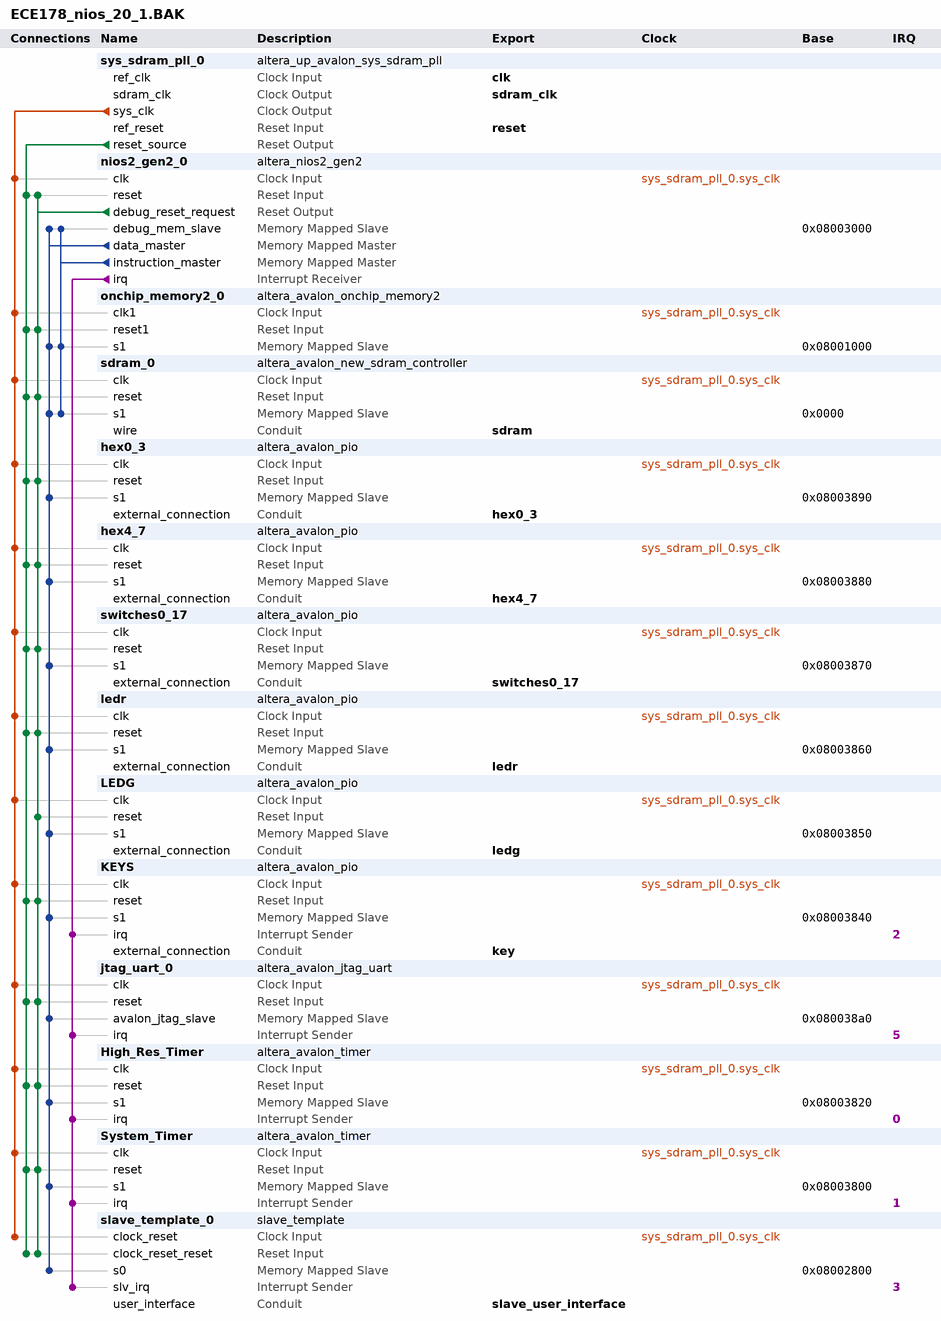
[diagram p0: system contents]
# Platform Designer (Qsys) system ECE178_nios_20_1.BAK, Cyclone IV E EP4CE115F29C7
# Parameters at their usual value, and those the tool derives, are not listed.
package require -exact qsys 20.1
create_system ECE178_nios_20_1.BAK
set_project_property DEVICE_FAMILY {Cyclone IV E}
set_project_property DEVICE EP4CE115F29C7

add_instance sys_sdram_pll_0 altera_up_avalon_sys_sdram_pll 18.0
set_instance_parameter_value sys_sdram_pll_0 CV_boards DE10-Standard
set_instance_parameter_value sys_sdram_pll_0 gui_outclk 50.0
set_instance_parameter_value sys_sdram_pll_0 gui_refclk 50.0

add_instance nios2_gen2_0 altera_nios2_gen2 20.1
set_instance_parameter_value nios2_gen2_0 dcache_size 2048
set_instance_parameter_value nios2_gen2_0 exceptionSlave sdram_0.s1
set_instance_parameter_value nios2_gen2_0 icache_size 2048
set_instance_parameter_value nios2_gen2_0 impl Tiny
set_instance_parameter_value nios2_gen2_0 resetSlave sdram_0.s1

add_instance onchip_memory2_0 altera_avalon_onchip_memory2 20.1
set_instance_parameter_value onchip_memory2_0 dataWidth 32
set_instance_parameter_value onchip_memory2_0 dualPort false
set_instance_parameter_value onchip_memory2_0 initMemContent true
set_instance_parameter_value onchip_memory2_0 initializationFileName onchip_mem.hex
set_instance_parameter_value onchip_memory2_0 memorySize 4096

add_instance sdram_0 altera_avalon_new_sdram_controller 20.1
set_instance_parameter_value sdram_0 TAC 5.5
set_instance_parameter_value sdram_0 TRCD 20.0
set_instance_parameter_value sdram_0 TRP 20.0
set_instance_parameter_value sdram_0 casLatency 3
set_instance_parameter_value sdram_0 columnWidth 10
set_instance_parameter_value sdram_0 dataWidth 32
set_instance_parameter_value sdram_0 generateSimulationModel false
set_instance_parameter_value sdram_0 model single_Micron_MT48LC4M32B2_7_chip
set_instance_parameter_value sdram_0 numberOfBanks 4
set_instance_parameter_value sdram_0 numberOfChipSelects 1
set_instance_parameter_value sdram_0 powerUpDelay 200.0
set_instance_parameter_value sdram_0 refreshPeriod 7.8125
set_instance_parameter_value sdram_0 rowWidth 13

add_instance hex0_3 altera_avalon_pio 20.1
set_instance_parameter_value hex0_3 direction Output
set_instance_parameter_value hex0_3 width 32

add_instance hex4_7 altera_avalon_pio 20.1
set_instance_parameter_value hex4_7 direction Output
set_instance_parameter_value hex4_7 width 32

add_instance switches0_17 altera_avalon_pio 20.1
set_instance_parameter_value switches0_17 direction Input
set_instance_parameter_value switches0_17 width 18

add_instance ledr altera_avalon_pio 20.1
set_instance_parameter_value ledr direction Output
set_instance_parameter_value ledr width 18

add_instance LEDG altera_avalon_pio 20.1
set_instance_parameter_value LEDG direction Output
set_instance_parameter_value LEDG width 9

add_instance KEYS altera_avalon_pio 20.1
set_instance_parameter_value KEYS captureEdge true
set_instance_parameter_value KEYS direction Input
set_instance_parameter_value KEYS edgeType ANY
set_instance_parameter_value KEYS generateIRQ true
set_instance_parameter_value KEYS width 4

add_instance jtag_uart_0 altera_avalon_jtag_uart 20.1
set_instance_parameter_value jtag_uart_0 simInteractiveOptions NO_INTERACTIVE_WINDOWS

add_instance High_Res_Timer altera_avalon_timer 20.1
set_instance_parameter_value High_Res_Timer period 1
set_instance_parameter_value High_Res_Timer periodUnits USEC

add_instance System_Timer altera_avalon_timer 20.1
set_instance_parameter_value System_Timer period 1
set_instance_parameter_value System_Timer periodUnits MSEC

add_instance slave_template_0 slave_template 2.0
set_instance_parameter_value slave_template_0 DATA_WIDTH 32
set_instance_parameter_value slave_template_0 ENABLE_SYNC_SIGNALS 0
set_instance_parameter_value slave_template_0 IRQ_EN 0
set_instance_parameter_value slave_template_0 MODE_0 2
set_instance_parameter_value slave_template_0 MODE_1 2
set_instance_parameter_value slave_template_0 MODE_10 2
set_instance_parameter_value slave_template_0 MODE_11 2
set_instance_parameter_value slave_template_0 MODE_12 2
set_instance_parameter_value slave_template_0 MODE_13 2
set_instance_parameter_value slave_template_0 MODE_14 2
set_instance_parameter_value slave_template_0 MODE_15 2
set_instance_parameter_value slave_template_0 MODE_2 2
set_instance_parameter_value slave_template_0 MODE_3 2
set_instance_parameter_value slave_template_0 MODE_4 2
set_instance_parameter_value slave_template_0 MODE_5 2
set_instance_parameter_value slave_template_0 MODE_6 2
set_instance_parameter_value slave_template_0 MODE_7 2
set_instance_parameter_value slave_template_0 MODE_8 2
set_instance_parameter_value slave_template_0 MODE_9 2

# connections
add_connection sys_sdram_pll_0.sys_clk hex0_3.clk clock
add_connection sys_sdram_pll_0.sys_clk hex4_7.clk clock
add_connection sys_sdram_pll_0.sys_clk High_Res_Timer.clk clock
add_connection sys_sdram_pll_0.sys_clk jtag_uart_0.clk clock
add_connection sys_sdram_pll_0.sys_clk KEYS.clk clock
add_connection sys_sdram_pll_0.sys_clk LEDG.clk clock
add_connection sys_sdram_pll_0.sys_clk ledr.clk clock
add_connection sys_sdram_pll_0.sys_clk nios2_gen2_0.clk clock
add_connection sys_sdram_pll_0.sys_clk onchip_memory2_0.clk1 clock
add_connection sys_sdram_pll_0.sys_clk sdram_0.clk clock
add_connection sys_sdram_pll_0.sys_clk slave_template_0.clock_reset clock
add_connection sys_sdram_pll_0.sys_clk switches0_17.clk clock
add_connection sys_sdram_pll_0.sys_clk System_Timer.clk clock
add_connection nios2_gen2_0.debug_reset_request hex0_3.reset reset
add_connection nios2_gen2_0.debug_reset_request hex4_7.reset reset
add_connection nios2_gen2_0.debug_reset_request High_Res_Timer.reset reset
add_connection nios2_gen2_0.debug_reset_request jtag_uart_0.reset reset
add_connection nios2_gen2_0.debug_reset_request KEYS.reset reset
add_connection nios2_gen2_0.debug_reset_request LEDG.reset reset
add_connection nios2_gen2_0.debug_reset_request ledr.reset reset
add_connection nios2_gen2_0.debug_reset_request nios2_gen2_0.reset reset
add_connection nios2_gen2_0.debug_reset_request onchip_memory2_0.reset1 reset
add_connection nios2_gen2_0.debug_reset_request sdram_0.reset reset
add_connection nios2_gen2_0.debug_reset_request slave_template_0.clock_reset_reset reset
add_connection nios2_gen2_0.debug_reset_request switches0_17.reset reset
add_connection nios2_gen2_0.debug_reset_request System_Timer.reset reset
add_connection sys_sdram_pll_0.reset_source hex0_3.reset reset
add_connection sys_sdram_pll_0.reset_source hex4_7.reset reset
add_connection sys_sdram_pll_0.reset_source High_Res_Timer.reset reset
add_connection sys_sdram_pll_0.reset_source jtag_uart_0.reset reset
add_connection sys_sdram_pll_0.reset_source KEYS.reset reset
add_connection sys_sdram_pll_0.reset_source ledr.reset reset
add_connection sys_sdram_pll_0.reset_source nios2_gen2_0.reset reset
add_connection sys_sdram_pll_0.reset_source onchip_memory2_0.reset1 reset
add_connection sys_sdram_pll_0.reset_source sdram_0.reset reset
add_connection sys_sdram_pll_0.reset_source slave_template_0.clock_reset_reset reset
add_connection sys_sdram_pll_0.reset_source switches0_17.reset reset
add_connection sys_sdram_pll_0.reset_source System_Timer.reset reset
add_connection nios2_gen2_0.data_master hex0_3.s1 avalon
set_connection_parameter_value nios2_gen2_0.data_master/hex0_3.s1 baseAddress 0x08003890
add_connection nios2_gen2_0.data_master hex4_7.s1 avalon
set_connection_parameter_value nios2_gen2_0.data_master/hex4_7.s1 baseAddress 0x08003880
add_connection nios2_gen2_0.data_master High_Res_Timer.s1 avalon
set_connection_parameter_value nios2_gen2_0.data_master/High_Res_Timer.s1 baseAddress 0x08003820
add_connection nios2_gen2_0.data_master jtag_uart_0.avalon_jtag_slave avalon
set_connection_parameter_value nios2_gen2_0.data_master/jtag_uart_0.avalon_jtag_slave baseAddress 0x080038a0
add_connection nios2_gen2_0.data_master KEYS.s1 avalon
set_connection_parameter_value nios2_gen2_0.data_master/KEYS.s1 baseAddress 0x08003840
add_connection nios2_gen2_0.data_master LEDG.s1 avalon
set_connection_parameter_value nios2_gen2_0.data_master/LEDG.s1 baseAddress 0x08003850
add_connection nios2_gen2_0.data_master ledr.s1 avalon
set_connection_parameter_value nios2_gen2_0.data_master/ledr.s1 baseAddress 0x08003860
add_connection nios2_gen2_0.data_master nios2_gen2_0.debug_mem_slave avalon
set_connection_parameter_value nios2_gen2_0.data_master/nios2_gen2_0.debug_mem_slave baseAddress 0x08003000
add_connection nios2_gen2_0.data_master onchip_memory2_0.s1 avalon
set_connection_parameter_value nios2_gen2_0.data_master/onchip_memory2_0.s1 baseAddress 0x08001000
add_connection nios2_gen2_0.data_master sdram_0.s1 avalon
set_connection_parameter_value nios2_gen2_0.data_master/sdram_0.s1 baseAddress 0x0000
add_connection nios2_gen2_0.data_master slave_template_0.s0 avalon
set_connection_parameter_value nios2_gen2_0.data_master/slave_template_0.s0 baseAddress 0x08002800
add_connection nios2_gen2_0.data_master switches0_17.s1 avalon
set_connection_parameter_value nios2_gen2_0.data_master/switches0_17.s1 baseAddress 0x08003870
add_connection nios2_gen2_0.data_master System_Timer.s1 avalon
set_connection_parameter_value nios2_gen2_0.data_master/System_Timer.s1 baseAddress 0x08003800
add_connection nios2_gen2_0.instruction_master nios2_gen2_0.debug_mem_slave avalon
set_connection_parameter_value nios2_gen2_0.instruction_master/nios2_gen2_0.debug_mem_slave baseAddress 0x08003000
add_connection nios2_gen2_0.instruction_master onchip_memory2_0.s1 avalon
set_connection_parameter_value nios2_gen2_0.instruction_master/onchip_memory2_0.s1 baseAddress 0x08001000
add_connection nios2_gen2_0.instruction_master sdram_0.s1 avalon
set_connection_parameter_value nios2_gen2_0.instruction_master/sdram_0.s1 baseAddress 0x0000
add_connection nios2_gen2_0.irq High_Res_Timer.irq interrupt
set_connection_parameter_value nios2_gen2_0.irq/High_Res_Timer.irq irqNumber 0
add_connection nios2_gen2_0.irq jtag_uart_0.irq interrupt
set_connection_parameter_value nios2_gen2_0.irq/jtag_uart_0.irq irqNumber 5
add_connection nios2_gen2_0.irq KEYS.irq interrupt
set_connection_parameter_value nios2_gen2_0.irq/KEYS.irq irqNumber 2
add_connection nios2_gen2_0.irq slave_template_0.slv_irq interrupt
set_connection_parameter_value nios2_gen2_0.irq/slave_template_0.slv_irq irqNumber 3
add_connection nios2_gen2_0.irq System_Timer.irq interrupt
set_connection_parameter_value nios2_gen2_0.irq/System_Timer.irq irqNumber 1

# exported interfaces
add_interface clk clock sink
set_interface_property clk EXPORT_OF sys_sdram_pll_0.ref_clk
add_interface hex0_3 conduit end
set_interface_property hex0_3 EXPORT_OF hex0_3.external_connection
add_interface hex4_7 conduit end
set_interface_property hex4_7 EXPORT_OF hex4_7.external_connection
add_interface key conduit end
set_interface_property key EXPORT_OF KEYS.external_connection
add_interface ledg conduit end
set_interface_property ledg EXPORT_OF LEDG.external_connection
add_interface ledr conduit end
set_interface_property ledr EXPORT_OF ledr.external_connection
add_interface reset reset sink
set_interface_property reset EXPORT_OF sys_sdram_pll_0.ref_reset
add_interface sdram conduit end
set_interface_property sdram EXPORT_OF sdram_0.wire
add_interface sdram_clk clock source
set_interface_property sdram_clk EXPORT_OF sys_sdram_pll_0.sdram_clk
add_interface slave_user_interface conduit end
set_interface_property slave_user_interface EXPORT_OF slave_template_0.user_interface
add_interface switches0_17 conduit end
set_interface_property switches0_17 EXPORT_OF switches0_17.external_connection

set_interconnect_requirement {$system} qsys_mm.clockCrossingAdapter HANDSHAKE
set_interconnect_requirement {$system} qsys_mm.enableEccProtection FALSE
set_interconnect_requirement {$system} qsys_mm.insertDefaultSlave FALSE
set_interconnect_requirement {$system} qsys_mm.maxAdditionalLatency 1

save_system ECE178_nios_20_1.BAK.qsys
